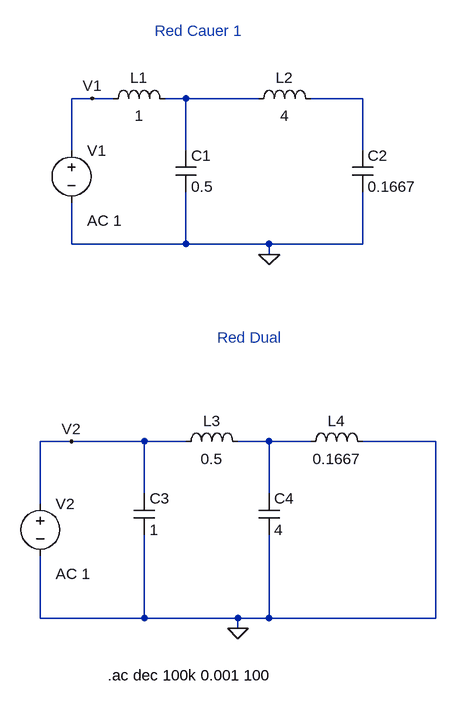
[diagram p0: schematic Cauer1.asc]
Cauer1.asc, the LTspice schematic file:
Version 4
SHEET 1 1676 680
WIRE -624 -768 -656 -768
WIRE -592 -768 -624 -768
WIRE -480 -768 -512 -768
WIRE -368 -768 -480 -768
WIRE -208 -768 -288 -768
WIRE -656 -688 -656 -768
WIRE -480 -688 -480 -768
WIRE -208 -688 -208 -768
WIRE -656 -544 -656 -608
WIRE -480 -544 -480 -624
WIRE -480 -544 -656 -544
WIRE -352 -544 -480 -544
WIRE -208 -544 -208 -624
WIRE -208 -544 -352 -544
WIRE -352 -528 -352 -544
WIRE -656 -240 -704 -240
WIRE -544 -240 -656 -240
WIRE -480 -240 -544 -240
WIRE -352 -240 -400 -240
WIRE -288 -240 -352 -240
WIRE -96 -240 -208 -240
WIRE -544 -160 -544 -240
WIRE -352 -160 -352 -240
WIRE -704 -144 -704 -240
WIRE -704 32 -704 -64
WIRE -544 32 -544 -96
WIRE -544 32 -704 32
WIRE -400 32 -544 32
WIRE -352 32 -352 -96
WIRE -352 32 -400 32
WIRE -96 32 -96 -240
WIRE -96 32 -352 32
WIRE -400 48 -400 32
FLAG -352 -528 0
FLAG -624 -768 V1
FLAG -656 -240 V2
FLAG -400 48 0
SYMBOL voltage -656 -704 R0
WINDOW 123 24 124 Left 2
WINDOW 39 0 0 Left 0
SYMATTR InstName V1
SYMATTR Value ""
SYMATTR Value2 AC 1
SYMBOL voltage -704 -160 R0
WINDOW 123 24 124 Left 2
WINDOW 39 0 0 Left 0
SYMATTR InstName V2
SYMATTR Value ""
SYMATTR Value2 AC 1
SYMBOL ind -608 -752 R270
WINDOW 0 32 56 VTop 2
WINDOW 3 5 56 VBottom 2
SYMATTR InstName L1
SYMATTR Value 1
SYMBOL ind -384 -752 R270
WINDOW 0 32 56 VTop 2
WINDOW 3 5 56 VBottom 2
SYMATTR InstName L2
SYMATTR Value 4
SYMBOL cap -496 -688 R0
SYMATTR InstName C1
SYMATTR Value 0.5
SYMBOL cap -224 -688 R0
SYMATTR InstName C2
SYMATTR Value 0.1667
SYMBOL cap -560 -160 R0
SYMATTR InstName C3
SYMATTR Value 1
SYMBOL ind -496 -224 R270
WINDOW 0 32 56 VTop 2
WINDOW 3 5 56 VBottom 2
SYMATTR InstName L3
SYMATTR Value 0.5
SYMBOL ind -304 -224 R270
WINDOW 0 32 56 VTop 2
WINDOW 3 5 56 VBottom 2
SYMATTR InstName L4
SYMATTR Value 0.1667
SYMBOL cap -368 -160 R0
SYMATTR InstName C4
SYMATTR Value 4
TEXT -600 120 Left 2 !.ac dec 100k 0.001 100
TEXT -528 -872 Left 2 ;Red Cauer 1
TEXT -432 -400 Left 2 ;Red Dual

The netlist it stands for:
* Cauer1.asc
V1 V1 0 AC 1
V2 V2 0 AC 1
L1 V1 N001 1
L2 N001 N002 4
C1 N001 0 0.5
C2 N002 0 0.1667
C3 V2 0 1
L3 V2 N003 0.5
L4 N003 0 0.1667
C4 N003 0 4
.ac dec 100k 0.001 100
* Red Cauer 1
* Red Dual
.backanno
.end